# Altium schematic sheet ControlsBoard.SchDoc
size A1
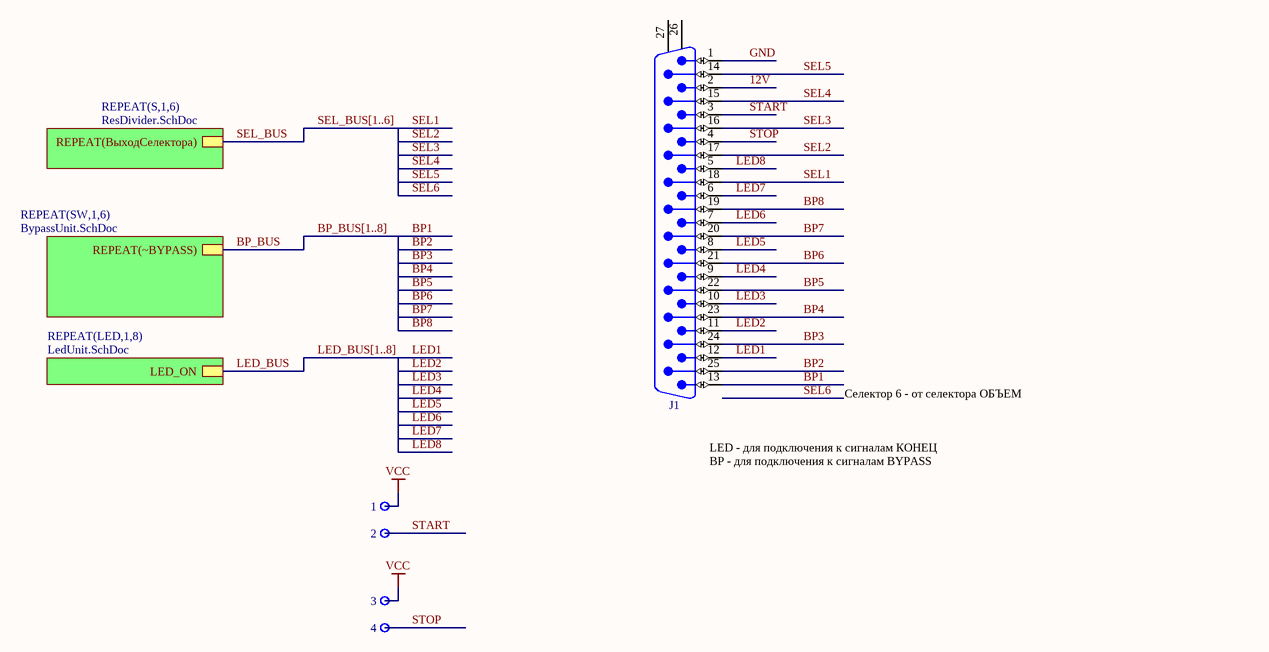
[diagram p0: ControlsBoard.SchDoc]

## Parts
1  Plated Hole  [c180h130]  (value not drawn)
2  Plated Hole  [c180h130]  (value not drawn)
3  Plated Hole  [c180h130]  (value not drawn)
4  Plated Hole  [c180h130]  (value not drawn)
J1  D-Sub  [AMPHENOL_L717DFB25P1ATN]  (value not drawn)

## Sub-sheets
REPEAT(LED,1,8) = LedUnit.SchDoc: LED_ON
REPEAT(S,1,6) = ResDivider.SchDoc: REPEAT(ВыходСелектора)
REPEAT(SW,1,6) = BypassUnit.SchDoc: REPEAT(~BYPASS)

## Nets
VCC: 1.1 3.1
12V: J1.2
BP1: J1.13
BP2: J1.25
BP3: J1.24
BP4: J1.23
BP5: J1.22
BP6: J1.21
BP7: J1.20
BP8: J1.19
BP_BUS: sheet REPEAT(SW,1,6)/REPEAT(~BYPASS)
GND: J1.1
LED1: J1.12
LED2: J1.11
LED3: J1.10
LED4: J1.9
LED5: J1.8
LED6: J1.7
LED7: J1.6
LED8: J1.5
LED_BUS: sheet REPEAT(LED,1,8)/LED_ON
SEL1: J1.18
SEL2: J1.17
SEL3: J1.16
SEL4: J1.15
SEL5: J1.14
SEL_BUS: sheet REPEAT(S,1,6)/REPEAT(ВыходСелектора)
START: 2.1 J1.3
STOP: 4.1 J1.4

Not connected (* = marked no-connect by the designer): J1 26 27

## Buses and harness runs
bus BP_BUS[1..8]
bus LED_BUS[1..8]
bus SEL_BUS[1..6]

## Notes on the sheet
- Селектор 6 - от селектора ОБЪЕМ
- LED - для подключения к сигналам КОНЕЦ
  BP - для подключения к сигналам BYPASS
  SEL

## Library data of the parts
1-4 = PLATED_HOLE1.3_PAD1.8: Single Terminal Socket; Part Description: Plated Through Hole: Hole Dia.=1.3mm Pad Dia.=1.8mm; Mounted: No; Table: Pads; Part Number: PLATED_HOLE1.3_PAD1.8; Component Kind: Standard (No BOM); Component Type: Standard (No BOM); Pin Count: 1; Family: Plated Hole; Socket: No; SMD: No; Status: None; ComponentHeight: 0mm; Author: CERN DEM JLC; CreateDate: 30.10.2008; LatestRevisionDate: 30.10.2008; PackageDescription: Plated Through Hole: Hole Dia.=1.3mm Pad Dia.=1.8mm
J1 = AMPHENOL_L717DFB25P1ATN: Connector D-sub 25 Male; Part Description: Right Angled D-Sub 25 Male Contacts with Metal Bracket and Front Female Screwlock (UNC4-40); Part Number: AMPHENOL_L717DFB25P1ATN; Component Kind: Standard; Component Type: Standard; Pin Count: 27; Family: D-Sub; Mounted: Yes; Socket: No; SMD: No; Status: None; Manufacturer: AMPHENOL; Manufacturer Part Number: L717DFB25P1ATN; ComponentHeight: 13.4mm; HelpURL: \\cern.ch\dfs\Applications\Altium\Datasheets\AMPHENOL_L717DFB25P1ATN.pdf; Author: CERN DEM JLC; CreateDate: 03.06.2009; LatestRevisionDate: 14.07.2011; Table: AMPHENOL